# EasyEDA schematic SCH_USBASP AVR Programmer module._2021-07-30.json
TITLE: USBASP AVR programmer module; REV: 1.0; Date: 2021-07-17; Sheet: 1/1; Drawn By: susilbehera486; Company: Your Company
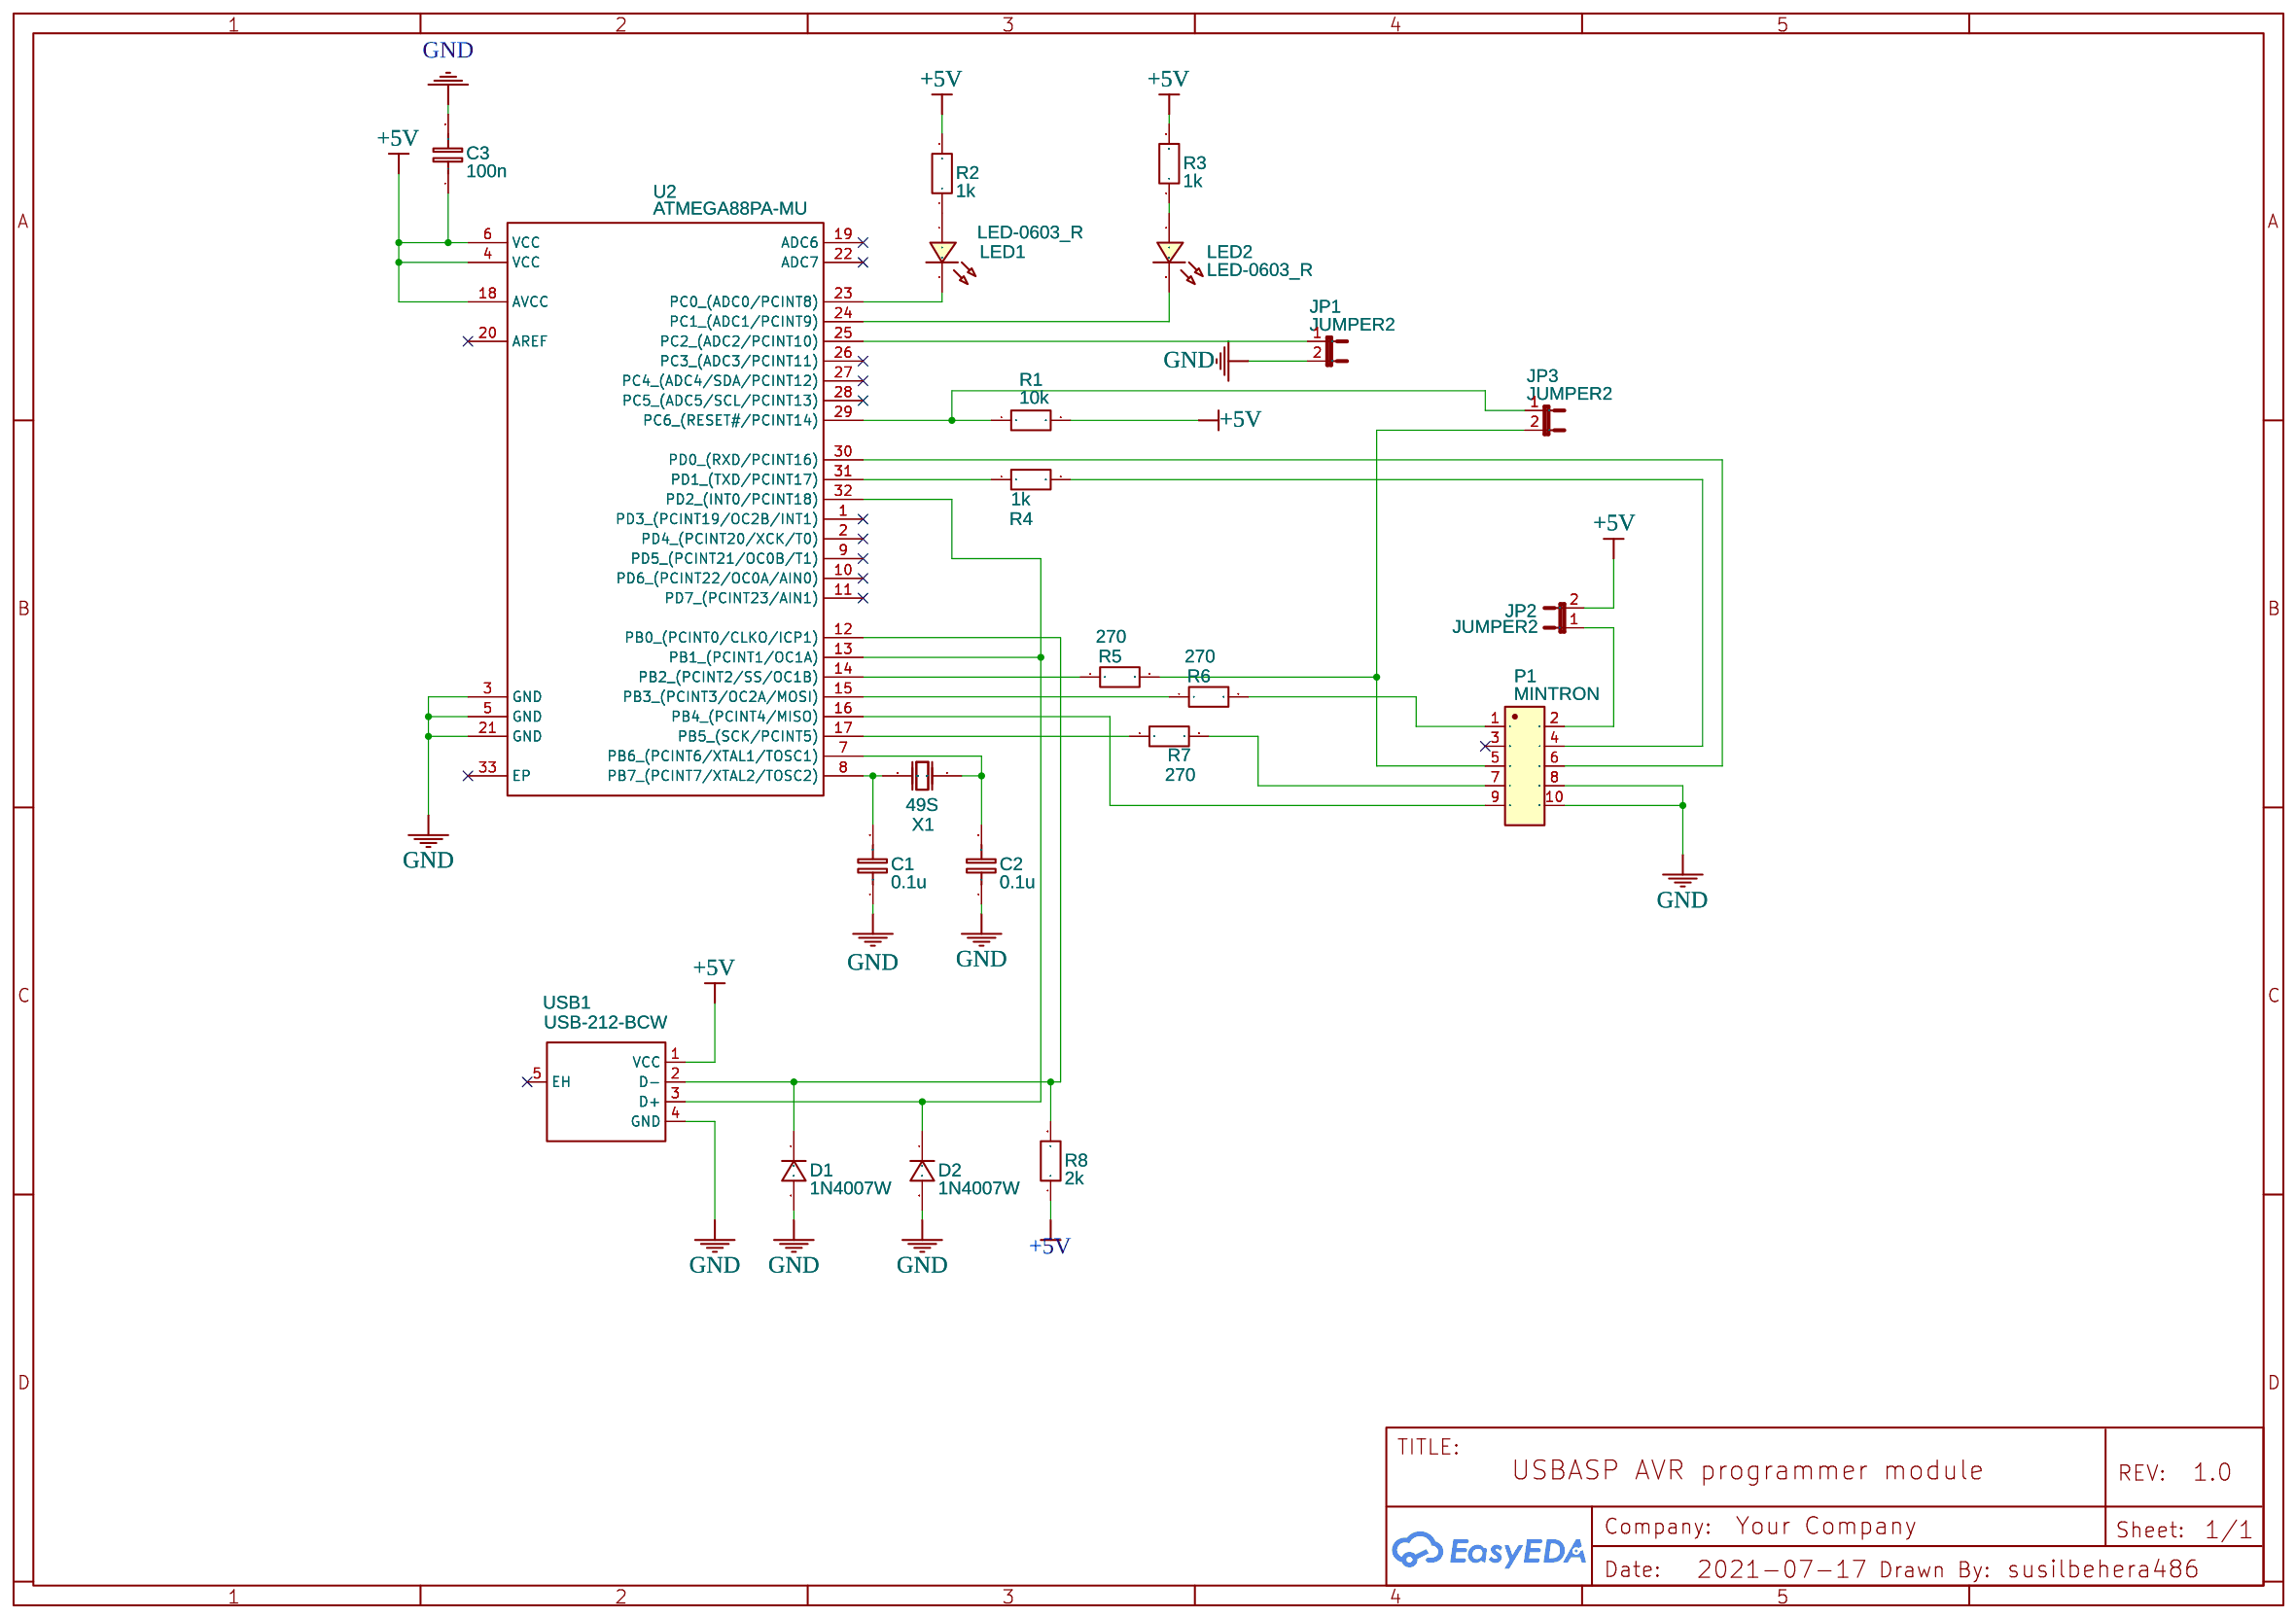
[diagram p0: schematic sheet]

## Parts
C1  0.1u  [C0603]
C2  0.1u  [C0603]
C3  100n  [C0603]
D1  1N4007W  [SOD-123_L2.8-W1.8-LS3.7-RD]
D2  1N4007W  [SOD-123_L2.8-W1.8-LS3.7-RD]
JP1  JUMPER2  [JUMPER2]
JP2  JUMPER2  [JUMPER2]
JP3  JUMPER2  [JUMPER2]
LED1  LED-0603_R  [LED0603_RED]
LED2  LED-0603_R  [LED0603_RED]
P1  MINTRON  [IDC-TH_MTB111-10S]
R1  10k  [R0603]
R2  1k  [R0603]
R3  1k  [R0603]
R4  1k  [R0603]
R5  270  [R0603]
R6  270  [R0603]
R7  270  [R0603]
R8  2k  [R0603]
U2  ATMEGA88PA-MU  [MLF-32_L5.0-W5.0-P0.50-TL-EP]
USB1  USB-212-BCW  [USB-A-SMD_USB-212-BCW]
X1  49S  [HC-49S_L11.0-W4.4-P4.88]

## Library data of the parts
C1-C3 = C_0603_EU: Contributor: LCEDA_Lib
D1 D2 = 1N4007W: Supplier: LCSC; Supplier Part: C328592; Manufacturer: BLUE ROCKET; Contributor: LCEDA_Lib
JP1-JP3 = JUMPER2: Jumper 2 Pin; Contributor: PatternAgents
LED1 LED2 = LED-0603_R: Manufacturer: EVERLIGHT(台湾亿光); Manufacturer Part: 19-217/R6C-AL1M2VY/3T; Supplier Part: C72044; Supplier: LCSC; Contributor: LCEDA_01
P1 = Con2x5: Supplier: LCSC; Supplier Part: C376112; Manufacturer Part: MTB111-10S; Contributor: vican45
R1-R8 = R_0603_EU: Contributor: LCEDA_Lib
U2 = ATMEGA88PA-MU: Supplier: LCSC; Manufacturer: MICROCHIP; Supplier Part: C111457; Paste Type: Extended Part; JLCPCB Part Class: Extended Part
USB1 = USB-212-BCW: Supplier: LCSC; Supplier Part: C720521; Manufacturer: XUNPU; Contributor: LCSC; JLCPCB Part Class: Extended Part
X1 = 49S DIP Crystal insulation film: Supplier: LCSC; Manufacturer: YXC; Supplier Part: C35018

## Nets
+5V: C3.1 JP2.2 R1.2 R2.2 R3.2 R8.1 U2.4(VCC) U2.6(VCC) U2.18(AVCC) USB1.1(VCC)
GND: C1.1 C2.1 C3.2 D1.2 D2.2 JP1.2 P1.8 P1.10 U2.3(GND) U2.5(GND) U2.21(GND) USB1.4(GND)
Net-(C1-2): C1.2 U2.8(PB7 (PCINT7/XTAL2/TOSC2)) X1.2(OSC2)
Net-(C2-2): C2.2 U2.7(PB6 (PCINT6/XTAL1/TOSC1)) X1.1(OSC1)
Net-(D1-1): D1.1 R8.2 U2.12(PB0 (PCINT0/CLKO/ICP1)) USB1.2(D-)
Net-(D2-1): D2.1 U2.13(PB1 (PCINT1/OC1A)) U2.32(PD2 (INT0/PCINT18)) USB1.3(D+)
Net-(JP1-1): JP1.1 U2.25(PC2 (ADC2/PCINT10))
Net-(JP2-1): JP2.1 P1.2
Net-(JP3-1): JP3.1 R1.1 U2.29(PC6 (RESET#/PCINT14))
Net-(JP3-2): JP3.2 P1.5 R5.2
Net-(LED1-1): LED1.1 R2.1
Net-(LED1-2): LED1.2 U2.23(PC0 (ADC0/PCINT8))
Net-(LED2-1): LED2.1 R3.1
Net-(LED2-2): LED2.2 U2.24(PC1 (ADC1/PCINT9))
Net-(P1-1): P1.1 R6.2
Net-(P1-4): P1.4 R4.2
Net-(P1-6): P1.6 U2.30(PD0 (RXD/PCINT16))
Net-(P1-7): P1.7 R7.2
Net-(P1-9): P1.9 U2.16(PB4 (PCINT4/MISO))
Net-(R4-1): R4.1 U2.31(PD1 (TXD/PCINT17))
Net-(R5-1): R5.1 U2.14(PB2 (PCINT2/SS/OC1B))
Net-(R6-1): R6.1 U2.15(PB3 (PCINT3/OC2A/MOSI))
Net-(R7-1): R7.1 U2.17(PB5 (SCK/PCINT5))

Not connected (* = marked no-connect by the designer): P1 3*; U2 1(PD3 (PCINT19/OC2B/INT1))* 2(PD4 (PCINT20/XCK/T0))* 9(PD5 (PCINT21/OC0B/T1))* 10(PD6 (PCINT22/OC0A/AIN0))* 11(PD7 (PCINT23/AIN1))* 19(ADC6)* 20(AREF)* 22(ADC7)* 26(PC3 (ADC3/PCINT11))* 27(PC4 (ADC4/SDA/PCINT12))* 28(PC5 (ADC5/SCL/PCINT13))* 33(EP)*; USB1 5(EH)*
